# EAGLE schematic VNH2SP30e (EAGLE 7.2.0)
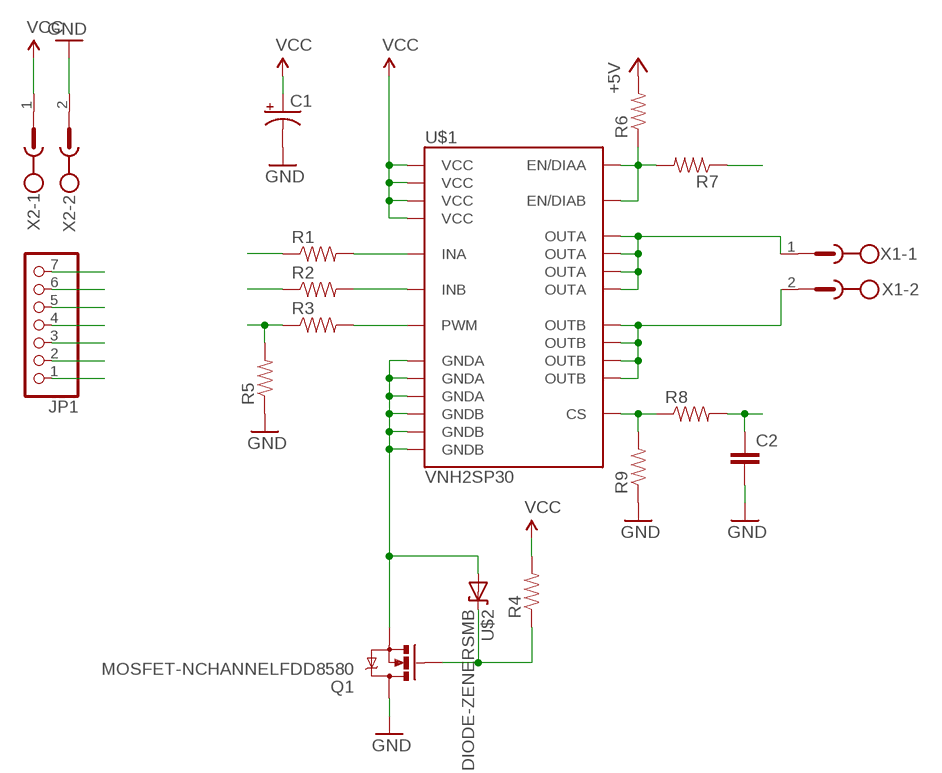
[diagram p0: schematic, sheet 1]

## Parts
C1  CAP_POLG  [PANASONIC_G]
C2  CAP1206  [1206]
JP1  PINHD-1X7  [1X07]
Q1  MOSFET-NCHANNELFDD8580  [DPAK]
R1  RESISTOR1206  [1206]
R2  RESISTOR1206  [1206]
R3  RESISTOR1206  [1206]
R4  RESISTOR1206  [1206]
R5  RESISTOR1206  [1206]
R6  RESISTOR1206  [1206]
R7  RESISTOR1206  [1206]
R8  RESISTOR1206  [1206]
R9  RESISTOR1206  [1206]
U$1  VNH2SP30  [VNH2SP30]
U$2  DIODE-ZENERSMB  [SMB-DIODE]
X1  MSTBV2  [MSTBV2]
X2  MSTBV2  [MSTBV2]

## Nets
+5V: JP1.7 R6.2
CS: C2.1 JP1.2 R8.2
EN: JP1.6 R7.1
GND: C1.- C2.2 JP1.1 Q1.4(D) R5.1 R9.1 X2.2
INA: JP1.5 R1.1
INB: JP1.4 R2.1
N$1: U$1.15(OUTB) U$1.16(OUTB) U$1.21(OUTB) U$1.SLUG2(OUTB) X1.2
N$2: Q1.3(S) U$1.18(GNDB) U$1.19(GNDB) U$1.20(GNDB) U$1.26(GNDA) U$1.27(GNDA) U$1.28(GNDA) U$2.A
N$3: R1.2 U$1.5(INA)
N$4: R2.2 U$1.11(INB)
N$5: R3.2 U$1.8(PWM)
N$6: Q1.1(G) R4.1 U$2.C
N$11: R8.1 R9.2 U$1.9(CS)
N$12: R6.1 R7.2 U$1.6(EN/DIAA) U$1.10(EN/DIAB)
N$14: U$1.1(OUTA) U$1.25(OUTA) U$1.30(OUTA) U$1.SLUG3(OUTA) X1.1
PWM: JP1.3 R3.1 R5.2
VCC: C1.+ R4.2 U$1.3(VCC) U$1.13(VCC) U$1.23(VCC) U$1.SLUG1(VCC) X2.1

## Library data of the parts
C1 = SparkFun:CAP_POL: Capacitor Polarized These are standard SMD and PTH capacitors. Normally 10uF, 47uF, and 100uF in electrolytic and tantalum varieties. Always verify the external diameter of the through hole cap, it varies with capacity, voltage, and manufacturer. The EIA devices should be standard.
C2 = SparkFun:CAP: Capacitor Standard 0603 ceramic capacitor, and 0.1" leaded capacitor.
JP1 = pinhead:PINHD-1X7: PIN HEADER
Q1 = SparkFun:MOSFET-NCHANNEL
R1-R9 = SparkFun:RESISTOR: Resistor Basic schematic elements and footprints for 0603, 1206, and PTH 1/10th watt (small) resistors.
U$1 = SparkFun:VNH2SP30
U$2 = SparkFun:DIODE-ZENER: Zener Diode Production Part - 8199 3.4V Zener Voltage
X1 X2 = con-phoenix-500:MSTBV2: PHOENIX; OC_FARNELL: unknown; OC_NEWARK: unknown